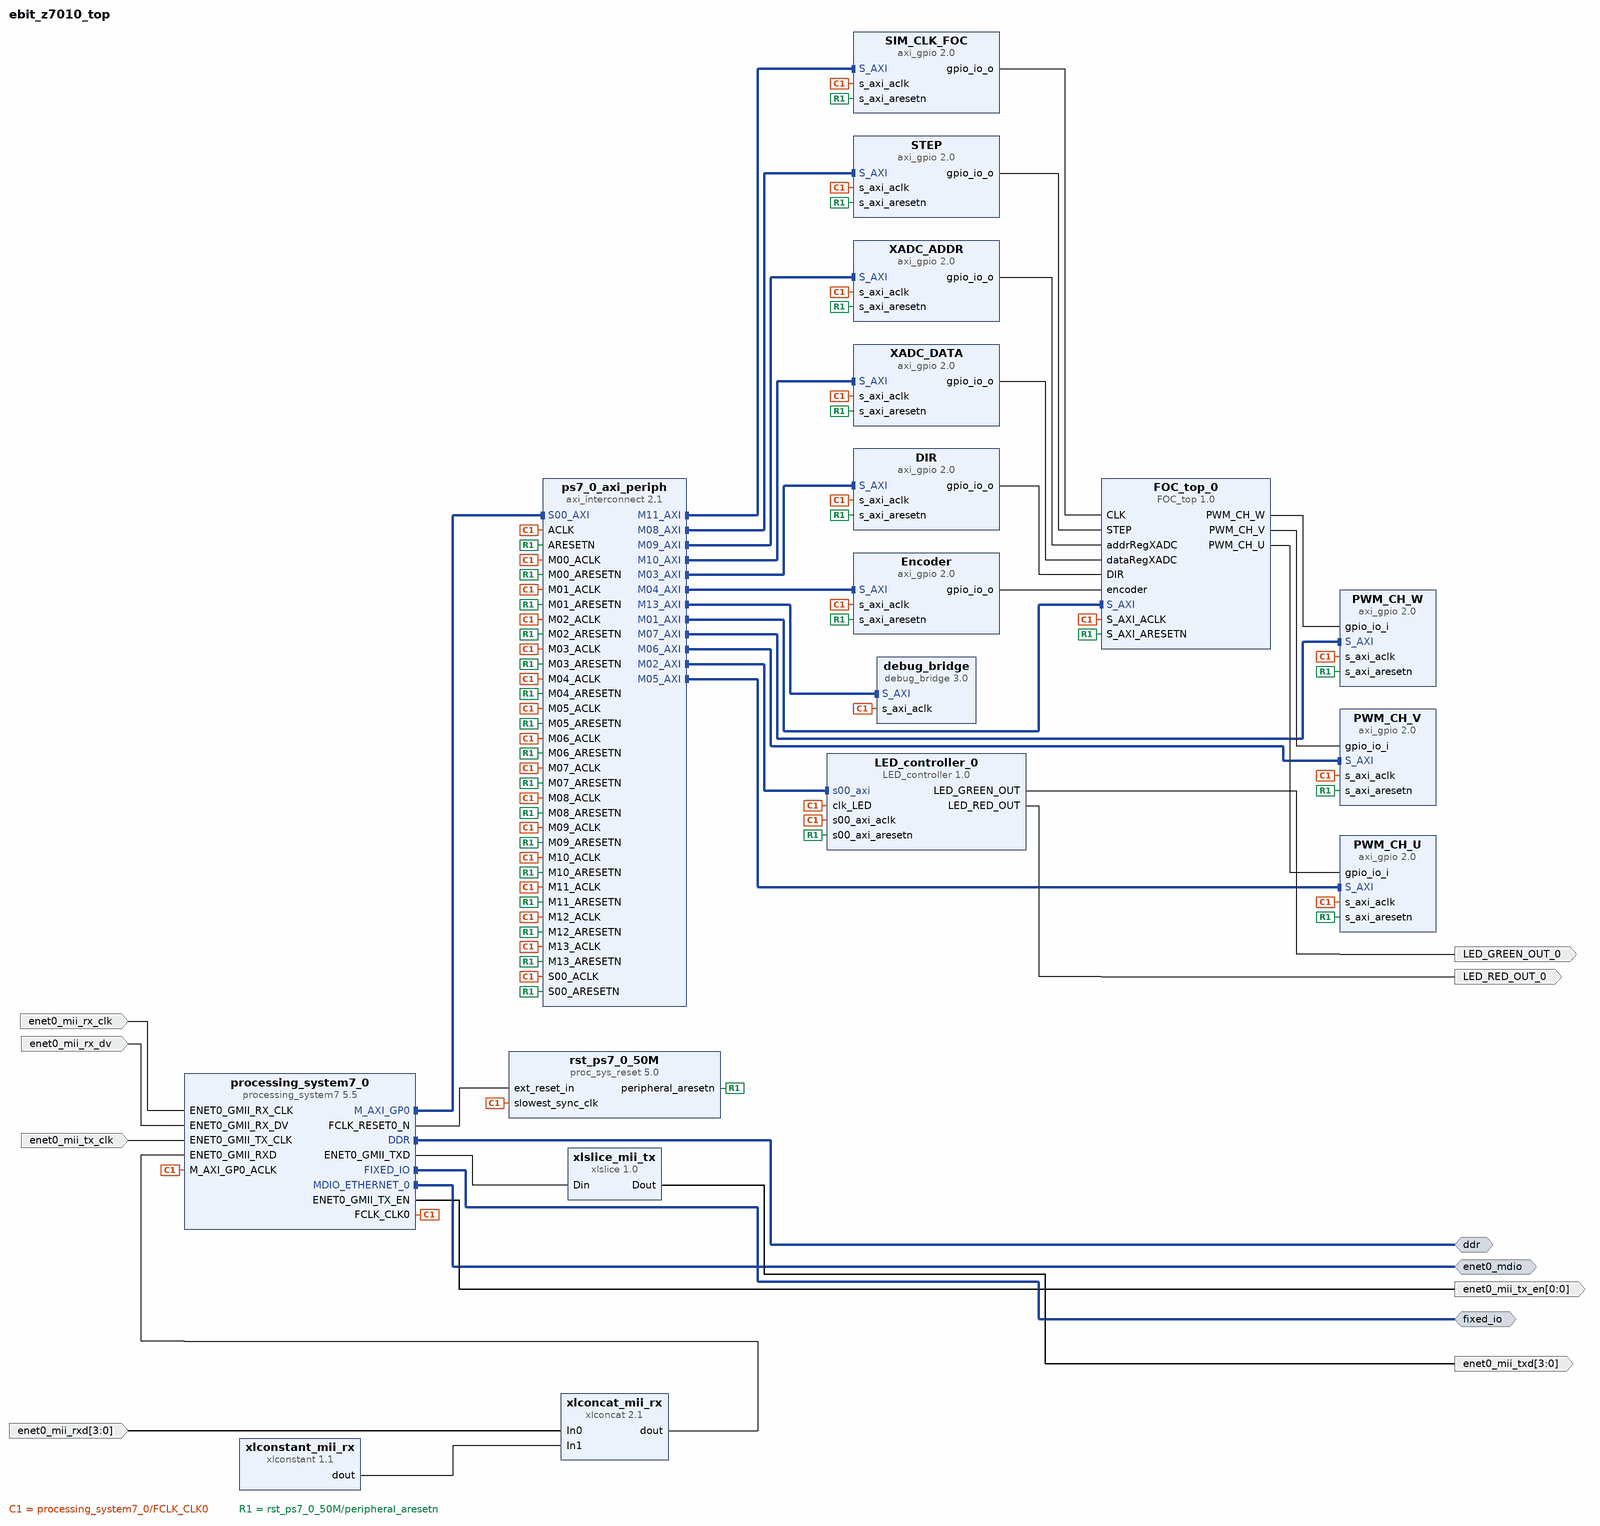
[diagram p0: block diagram of the top level]
# Vivado block design ebit_z7010_top, xc7z010clg400-1, Vivado 2022.1
create_bd_design ebit_z7010_top

create_bd_intf_port -mode Master -vlnv xilinx.com:interface:ddrx_rtl:1.0 ddr
create_bd_intf_port -mode Master -vlnv xilinx.com:display_processing_system7:fixedio_rtl:1.0 fixed_io
create_bd_intf_port -mode Master -vlnv xilinx.com:interface:mdio_rtl:1.0 enet0_mdio
create_bd_port -dir I enet0_mii_rx_dv
create_bd_port -dir I -type clk enet0_mii_rx_clk
create_bd_port -dir O -from 0 -to 0 enet0_mii_tx_en
create_bd_port -dir I -type clk enet0_mii_tx_clk
create_bd_port -dir O -from 3 -to 0 enet0_mii_txd
create_bd_port -dir I -from 3 -to 0 enet0_mii_rxd
create_bd_port -dir O LED_GREEN_OUT_0
create_bd_port -dir O LED_RED_OUT_0

create_bd_cell -type ip -vlnv xilinx.com:ip:processing_system7:5.5 processing_system7_0
set_property -dict [list \
  CONFIG.PCW_ENET0_ENET0_IO EMIO \
  CONFIG.PCW_ENET0_GRP_MDIO_ENABLE 1 \
  CONFIG.PCW_ENET0_GRP_MDIO_IO EMIO \
  CONFIG.PCW_ENET0_PERIPHERAL_ENABLE 1 \
  CONFIG.PCW_ENET0_PERIPHERAL_FREQMHZ {100 Mbps} \
  CONFIG.PCW_ENET_RESET_ENABLE 0 \
  CONFIG.PCW_FPGA0_PERIPHERAL_FREQMHZ 100 \
  CONFIG.PCW_GPIO_EMIO_GPIO_ENABLE 1 \
  CONFIG.PCW_GPIO_EMIO_GPIO_IO 2 \
  CONFIG.PCW_GPIO_EMIO_GPIO_WIDTH 2 \
  CONFIG.PCW_GPIO_MIO_GPIO_ENABLE 1 \
  CONFIG.PCW_GPIO_MIO_GPIO_IO MIO \
  CONFIG.PCW_I2C_RESET_ENABLE 0 \
  CONFIG.PCW_NAND_NAND_IO {MIO 0 2.. 14} \
  CONFIG.PCW_NAND_PERIPHERAL_ENABLE 1 \
  CONFIG.PCW_SD0_GRP_CD_ENABLE 0 \
  CONFIG.PCW_SD0_GRP_WP_ENABLE 0 \
  CONFIG.PCW_SD0_PERIPHERAL_ENABLE 1 \
  CONFIG.PCW_SD0_SD0_IO {MIO 40 .. 45} \
  CONFIG.PCW_SDIO_PERIPHERAL_FREQMHZ 100 \
  CONFIG.PCW_UART1_PERIPHERAL_ENABLE 1 \
  CONFIG.PCW_UART1_UART1_IO {MIO 24 .. 25} \
  CONFIG.PCW_UART_PERIPHERAL_FREQMHZ 100 \
  CONFIG.PCW_UIPARAM_DDR_BUS_WIDTH {16 Bit} \
  CONFIG.PCW_UIPARAM_DDR_PARTNO {MT41K128M16 JT-125} \
  CONFIG.PCW_USB_RESET_ENABLE 0 \
] [get_bd_cells processing_system7_0]
# 202 more settings of processing_system7_0 are not shown: defaults, MIO pin electricals, DDR timing, and values the tool derives
create_bd_cell -type ip -vlnv xilinx.com:ip:xlconstant:1.1 xlconstant_mii_rx
set_property -dict {CONFIG.CONST_VAL 0 CONFIG.CONST_WIDTH 4} [get_bd_cells xlconstant_mii_rx]
create_bd_cell -type ip -vlnv xilinx.com:ip:xlslice:1.0 xlslice_mii_tx
set_property -dict {CONFIG.DIN_FROM 3 CONFIG.DIN_TO 0 CONFIG.DIN_WIDTH 8 CONFIG.DOUT_WIDTH 4} [get_bd_cells xlslice_mii_tx]
create_bd_cell -type ip -vlnv xilinx.com:ip:proc_sys_reset:5.0 rst_ps7_0_50M
create_bd_cell -type ip -vlnv xilinx.com:user:LED_controller:1.0 LED_controller_0
create_bd_cell -type ip -vlnv xilinx.com:ip:xlconcat:2.1 xlconcat_mii_rx
set_property -dict {CONFIG.IN0_WIDTH 4 CONFIG.IN1_WIDTH 4 CONFIG.dout_width 8} [get_bd_cells xlconcat_mii_rx]
create_bd_cell -type ip -vlnv xilinx.com:ip:axi_interconnect:2.1 ps7_0_axi_periph
set_property -dict {CONFIG.NUM_MI 14 CONFIG.NUM_SI 1 CONFIG.S00_HAS_DATA_FIFO 2 CONFIG.STRATEGY 2} [get_bd_cells ps7_0_axi_periph]
create_bd_cell -type ip -vlnv xilinx.com:ip:axi_gpio:2.0 XADC_ADDR
set_property -dict {CONFIG.C_ALL_OUTPUTS 1 CONFIG.C_GPIO_WIDTH 7} [get_bd_cells XADC_ADDR]
create_bd_cell -type ip -vlnv xilinx.com:ip:axi_gpio:2.0 XADC_DATA
set_property -dict {CONFIG.C_ALL_OUTPUTS 1 CONFIG.C_GPIO_WIDTH 16} [get_bd_cells XADC_DATA]
create_bd_cell -type ip -vlnv xilinx.com:ip:axi_gpio:2.0 Encoder
set_property -dict {CONFIG.C_ALL_OUTPUTS 1 CONFIG.C_GPIO_WIDTH 2} [get_bd_cells Encoder]
create_bd_cell -type ip -vlnv xilinx.com:ip:axi_gpio:2.0 STEP
set_property -dict {CONFIG.C_ALL_OUTPUTS 1 CONFIG.C_GPIO_WIDTH 1} [get_bd_cells STEP]
create_bd_cell -type ip -vlnv xilinx.com:ip:axi_gpio:2.0 DIR
set_property -dict {CONFIG.C_ALL_OUTPUTS 1 CONFIG.C_GPIO_WIDTH 1} [get_bd_cells DIR]
create_bd_cell -type ip -vlnv xilinx.com:ip:axi_gpio:2.0 PWM_CH_U
set_property -dict {CONFIG.C_ALL_INPUTS 1 CONFIG.C_GPIO_WIDTH 2} [get_bd_cells PWM_CH_U]
create_bd_cell -type ip -vlnv xilinx.com:ip:axi_gpio:2.0 PWM_CH_W
set_property -dict {CONFIG.C_ALL_INPUTS 1 CONFIG.C_GPIO_WIDTH 2} [get_bd_cells PWM_CH_W]
create_bd_cell -type ip -vlnv xilinx.com:ip:axi_gpio:2.0 PWM_CH_V
set_property -dict {CONFIG.C_ALL_INPUTS 1 CONFIG.C_GPIO_WIDTH 2} [get_bd_cells PWM_CH_V]
create_bd_cell -type ip -vlnv xilinx.com:ip:axi_gpio:2.0 SIM_CLK_FOC
set_property -dict {CONFIG.C_ALL_OUTPUTS 1 CONFIG.C_GPIO_WIDTH 1} [get_bd_cells SIM_CLK_FOC]
create_bd_cell -type ip -vlnv xilinx.com:ip:debug_bridge:3.0 debug_bridge
set_property -dict {CONFIG.C_DEBUG_MODE 2} [get_bd_cells debug_bridge]
create_bd_cell -type ip -vlnv xilinx.com:user:FOC_top:1.0 FOC_top_0

# ---- connections ----

connect_bd_intf_net [get_bd_intf_ports ddr] [get_bd_intf_pins processing_system7_0/DDR]
connect_bd_intf_net [get_bd_intf_ports fixed_io] [get_bd_intf_pins processing_system7_0/FIXED_IO]
connect_bd_intf_net [get_bd_intf_ports enet0_mdio] [get_bd_intf_pins processing_system7_0/MDIO_ETHERNET_0]
connect_bd_intf_net [get_bd_intf_pins processing_system7_0/M_AXI_GP0] [get_bd_intf_pins ps7_0_axi_periph/S00_AXI]
connect_bd_intf_net [get_bd_intf_pins ps7_0_axi_periph/M01_AXI] [get_bd_intf_pins FOC_top_0/S_AXI]
connect_bd_intf_net [get_bd_intf_pins LED_controller_0/s00_axi] [get_bd_intf_pins ps7_0_axi_periph/M02_AXI]
connect_bd_intf_net [get_bd_intf_pins ps7_0_axi_periph/M03_AXI] [get_bd_intf_pins DIR/S_AXI]
connect_bd_intf_net [get_bd_intf_pins ps7_0_axi_periph/M04_AXI] [get_bd_intf_pins Encoder/S_AXI]
connect_bd_intf_net [get_bd_intf_pins PWM_CH_U/S_AXI] [get_bd_intf_pins ps7_0_axi_periph/M05_AXI]
connect_bd_intf_net [get_bd_intf_pins ps7_0_axi_periph/M06_AXI] [get_bd_intf_pins PWM_CH_V/S_AXI]
connect_bd_intf_net [get_bd_intf_pins ps7_0_axi_periph/M07_AXI] [get_bd_intf_pins PWM_CH_W/S_AXI]
connect_bd_intf_net [get_bd_intf_pins ps7_0_axi_periph/M08_AXI] [get_bd_intf_pins STEP/S_AXI]
connect_bd_intf_net [get_bd_intf_pins ps7_0_axi_periph/M09_AXI] [get_bd_intf_pins XADC_ADDR/S_AXI]
connect_bd_intf_net [get_bd_intf_pins ps7_0_axi_periph/M10_AXI] [get_bd_intf_pins XADC_DATA/S_AXI]
connect_bd_intf_net [get_bd_intf_pins ps7_0_axi_periph/M11_AXI] [get_bd_intf_pins SIM_CLK_FOC/S_AXI]
connect_bd_intf_net [get_bd_intf_pins ps7_0_axi_periph/M13_AXI] [get_bd_intf_pins debug_bridge/S_AXI]
connect_bd_net [get_bd_pins DIR/gpio_io_o] [get_bd_pins FOC_top_0/DIR]
connect_bd_net -net ENET0_GMII_RX_CLK_0_1 [get_bd_ports enet0_mii_rx_clk] [get_bd_pins processing_system7_0/ENET0_GMII_RX_CLK]
connect_bd_net -net ENET0_GMII_RX_DV_0_1 [get_bd_ports enet0_mii_rx_dv] [get_bd_pins processing_system7_0/ENET0_GMII_RX_DV]
connect_bd_net -net ENET0_GMII_TX_CLK_0_1 [get_bd_ports enet0_mii_tx_clk] [get_bd_pins processing_system7_0/ENET0_GMII_TX_CLK]
connect_bd_net [get_bd_pins Encoder/gpio_io_o] [get_bd_pins FOC_top_0/encoder]
connect_bd_net [get_bd_pins FOC_top_0/PWM_CH_U] [get_bd_pins PWM_CH_U/gpio_io_i]
connect_bd_net [get_bd_pins FOC_top_0/PWM_CH_V] [get_bd_pins PWM_CH_V/gpio_io_i]
connect_bd_net [get_bd_pins FOC_top_0/PWM_CH_W] [get_bd_pins PWM_CH_W/gpio_io_i]
connect_bd_net -net In0_0_1 [get_bd_ports enet0_mii_rxd] [get_bd_pins xlconcat_mii_rx/In0]
connect_bd_net [get_bd_pins LED_controller_0/LED_GREEN_OUT] [get_bd_ports LED_GREEN_OUT_0]
connect_bd_net [get_bd_pins LED_controller_0/LED_RED_OUT] [get_bd_ports LED_RED_OUT_0]
connect_bd_net [get_bd_pins STEP/gpio_io_o] [get_bd_pins FOC_top_0/STEP]
connect_bd_net [get_bd_pins XADC_ADDR/gpio_io_o] [get_bd_pins FOC_top_0/addrRegXADC]
connect_bd_net [get_bd_pins XADC_DATA/gpio_io_o] [get_bd_pins FOC_top_0/dataRegXADC]
connect_bd_net -net axi_gpio_0_gpio_io_o [get_bd_pins SIM_CLK_FOC/gpio_io_o] [get_bd_pins FOC_top_0/CLK]
connect_bd_net [get_bd_pins processing_system7_0/ENET0_GMII_TXD] [get_bd_pins xlslice_mii_tx/Din]
connect_bd_net [get_bd_pins processing_system7_0/ENET0_GMII_TX_EN] [get_bd_ports enet0_mii_tx_en]
connect_bd_net [get_bd_pins processing_system7_0/FCLK_CLK0] \
  [get_bd_pins processing_system7_0/M_AXI_GP0_ACLK] [get_bd_pins rst_ps7_0_50M/slowest_sync_clk] \
  [get_bd_pins LED_controller_0/s00_axi_aclk] [get_bd_pins LED_controller_0/clk_LED] [get_bd_pins ps7_0_axi_periph/ACLK] \
  [get_bd_pins ps7_0_axi_periph/S00_ACLK] [get_bd_pins ps7_0_axi_periph/M00_ACLK] [get_bd_pins ps7_0_axi_periph/M01_ACLK] \
  [get_bd_pins ps7_0_axi_periph/M02_ACLK] [get_bd_pins ps7_0_axi_periph/M03_ACLK] [get_bd_pins DIR/s_axi_aclk] \
  [get_bd_pins Encoder/s_axi_aclk] [get_bd_pins ps7_0_axi_periph/M04_ACLK] [get_bd_pins PWM_CH_U/s_axi_aclk] \
  [get_bd_pins ps7_0_axi_periph/M05_ACLK] [get_bd_pins PWM_CH_V/s_axi_aclk] [get_bd_pins ps7_0_axi_periph/M06_ACLK] \
  [get_bd_pins PWM_CH_W/s_axi_aclk] [get_bd_pins ps7_0_axi_periph/M07_ACLK] [get_bd_pins STEP/s_axi_aclk] \
  [get_bd_pins ps7_0_axi_periph/M08_ACLK] [get_bd_pins XADC_ADDR/s_axi_aclk] [get_bd_pins ps7_0_axi_periph/M09_ACLK] \
  [get_bd_pins XADC_DATA/s_axi_aclk] [get_bd_pins ps7_0_axi_periph/M10_ACLK] [get_bd_pins SIM_CLK_FOC/s_axi_aclk] \
  [get_bd_pins ps7_0_axi_periph/M11_ACLK] [get_bd_pins ps7_0_axi_periph/M12_ACLK] [get_bd_pins debug_bridge/s_axi_aclk] \
  [get_bd_pins ps7_0_axi_periph/M13_ACLK] [get_bd_pins FOC_top_0/S_AXI_ACLK]
connect_bd_net [get_bd_pins processing_system7_0/FCLK_RESET0_N] [get_bd_pins rst_ps7_0_50M/ext_reset_in]
connect_bd_net [get_bd_pins rst_ps7_0_50M/peripheral_aresetn] \
  [get_bd_pins LED_controller_0/s00_axi_aresetn] [get_bd_pins ps7_0_axi_periph/ARESETN] \
  [get_bd_pins ps7_0_axi_periph/S00_ARESETN] [get_bd_pins ps7_0_axi_periph/M00_ARESETN] \
  [get_bd_pins ps7_0_axi_periph/M01_ARESETN] [get_bd_pins ps7_0_axi_periph/M02_ARESETN] \
  [get_bd_pins ps7_0_axi_periph/M03_ARESETN] [get_bd_pins DIR/s_axi_aresetn] [get_bd_pins Encoder/s_axi_aresetn] \
  [get_bd_pins ps7_0_axi_periph/M04_ARESETN] [get_bd_pins PWM_CH_U/s_axi_aresetn] [get_bd_pins ps7_0_axi_periph/M05_ARESETN] \
  [get_bd_pins PWM_CH_V/s_axi_aresetn] [get_bd_pins ps7_0_axi_periph/M06_ARESETN] [get_bd_pins PWM_CH_W/s_axi_aresetn] \
  [get_bd_pins ps7_0_axi_periph/M07_ARESETN] [get_bd_pins STEP/s_axi_aresetn] [get_bd_pins ps7_0_axi_periph/M08_ARESETN] \
  [get_bd_pins XADC_ADDR/s_axi_aresetn] [get_bd_pins ps7_0_axi_periph/M09_ARESETN] [get_bd_pins XADC_DATA/s_axi_aresetn] \
  [get_bd_pins ps7_0_axi_periph/M10_ARESETN] [get_bd_pins SIM_CLK_FOC/s_axi_aresetn] \
  [get_bd_pins ps7_0_axi_periph/M11_ARESETN] [get_bd_pins ps7_0_axi_periph/M12_ARESETN] \
  [get_bd_pins ps7_0_axi_periph/M13_ARESETN] [get_bd_pins FOC_top_0/S_AXI_ARESETN]
connect_bd_net -net xlconcat_0_dout [get_bd_pins xlconcat_mii_rx/dout] [get_bd_pins processing_system7_0/ENET0_GMII_RXD]
connect_bd_net -net xlconstant_0_dout [get_bd_pins xlconstant_mii_rx/dout] [get_bd_pins xlconcat_mii_rx/In1]
connect_bd_net -net xlslice_0_Dout [get_bd_pins xlslice_mii_tx/Dout] [get_bd_ports enet0_mii_txd]

# ---- address map ----
assign_bd_address -offset 0x40000000 -range 4K -target_address_space [get_bd_addr_spaces processing_system7_0/Data] [get_bd_addr_segs FOC_top_0/S_AXI/reg0]
assign_bd_address -offset 0x41200000 -range 64K -target_address_space [get_bd_addr_spaces processing_system7_0/Data] [get_bd_addr_segs DIR/S_AXI/Reg]
assign_bd_address -offset 0x41210000 -range 64K -target_address_space [get_bd_addr_spaces processing_system7_0/Data] [get_bd_addr_segs Encoder/S_AXI/Reg]
assign_bd_address -offset 0x41220000 -range 64K -target_address_space [get_bd_addr_spaces processing_system7_0/Data] [get_bd_addr_segs PWM_CH_U/S_AXI/Reg]
assign_bd_address -offset 0x41230000 -range 64K -target_address_space [get_bd_addr_spaces processing_system7_0/Data] [get_bd_addr_segs PWM_CH_V/S_AXI/Reg]
assign_bd_address -offset 0x41240000 -range 64K -target_address_space [get_bd_addr_spaces processing_system7_0/Data] [get_bd_addr_segs PWM_CH_W/S_AXI/Reg]
assign_bd_address -offset 0x41250000 -range 64K -target_address_space [get_bd_addr_spaces processing_system7_0/Data] [get_bd_addr_segs STEP/S_AXI/Reg]
assign_bd_address -offset 0x41260000 -range 64K -target_address_space [get_bd_addr_spaces processing_system7_0/Data] [get_bd_addr_segs XADC_ADDR/S_AXI/Reg]
assign_bd_address -offset 0x41270000 -range 64K -target_address_space [get_bd_addr_spaces processing_system7_0/Data] [get_bd_addr_segs XADC_DATA/S_AXI/Reg]
assign_bd_address -offset 0x41280000 -range 64K -target_address_space [get_bd_addr_spaces processing_system7_0/Data] [get_bd_addr_segs SIM_CLK_FOC/S_AXI/Reg]
assign_bd_address -offset 0x43C00000 -range 64K -target_address_space [get_bd_addr_spaces processing_system7_0/Data] [get_bd_addr_segs debug_bridge/S_AXI/Reg0]
assign_bd_address -offset 0x43C10000 -range 64K -target_address_space [get_bd_addr_spaces processing_system7_0/Data] [get_bd_addr_segs LED_controller_0/s00_axi/reg0]

validate_bd_design
save_bd_design
